# EAGLE design high-side-switch (EAGLE 9.6.2)
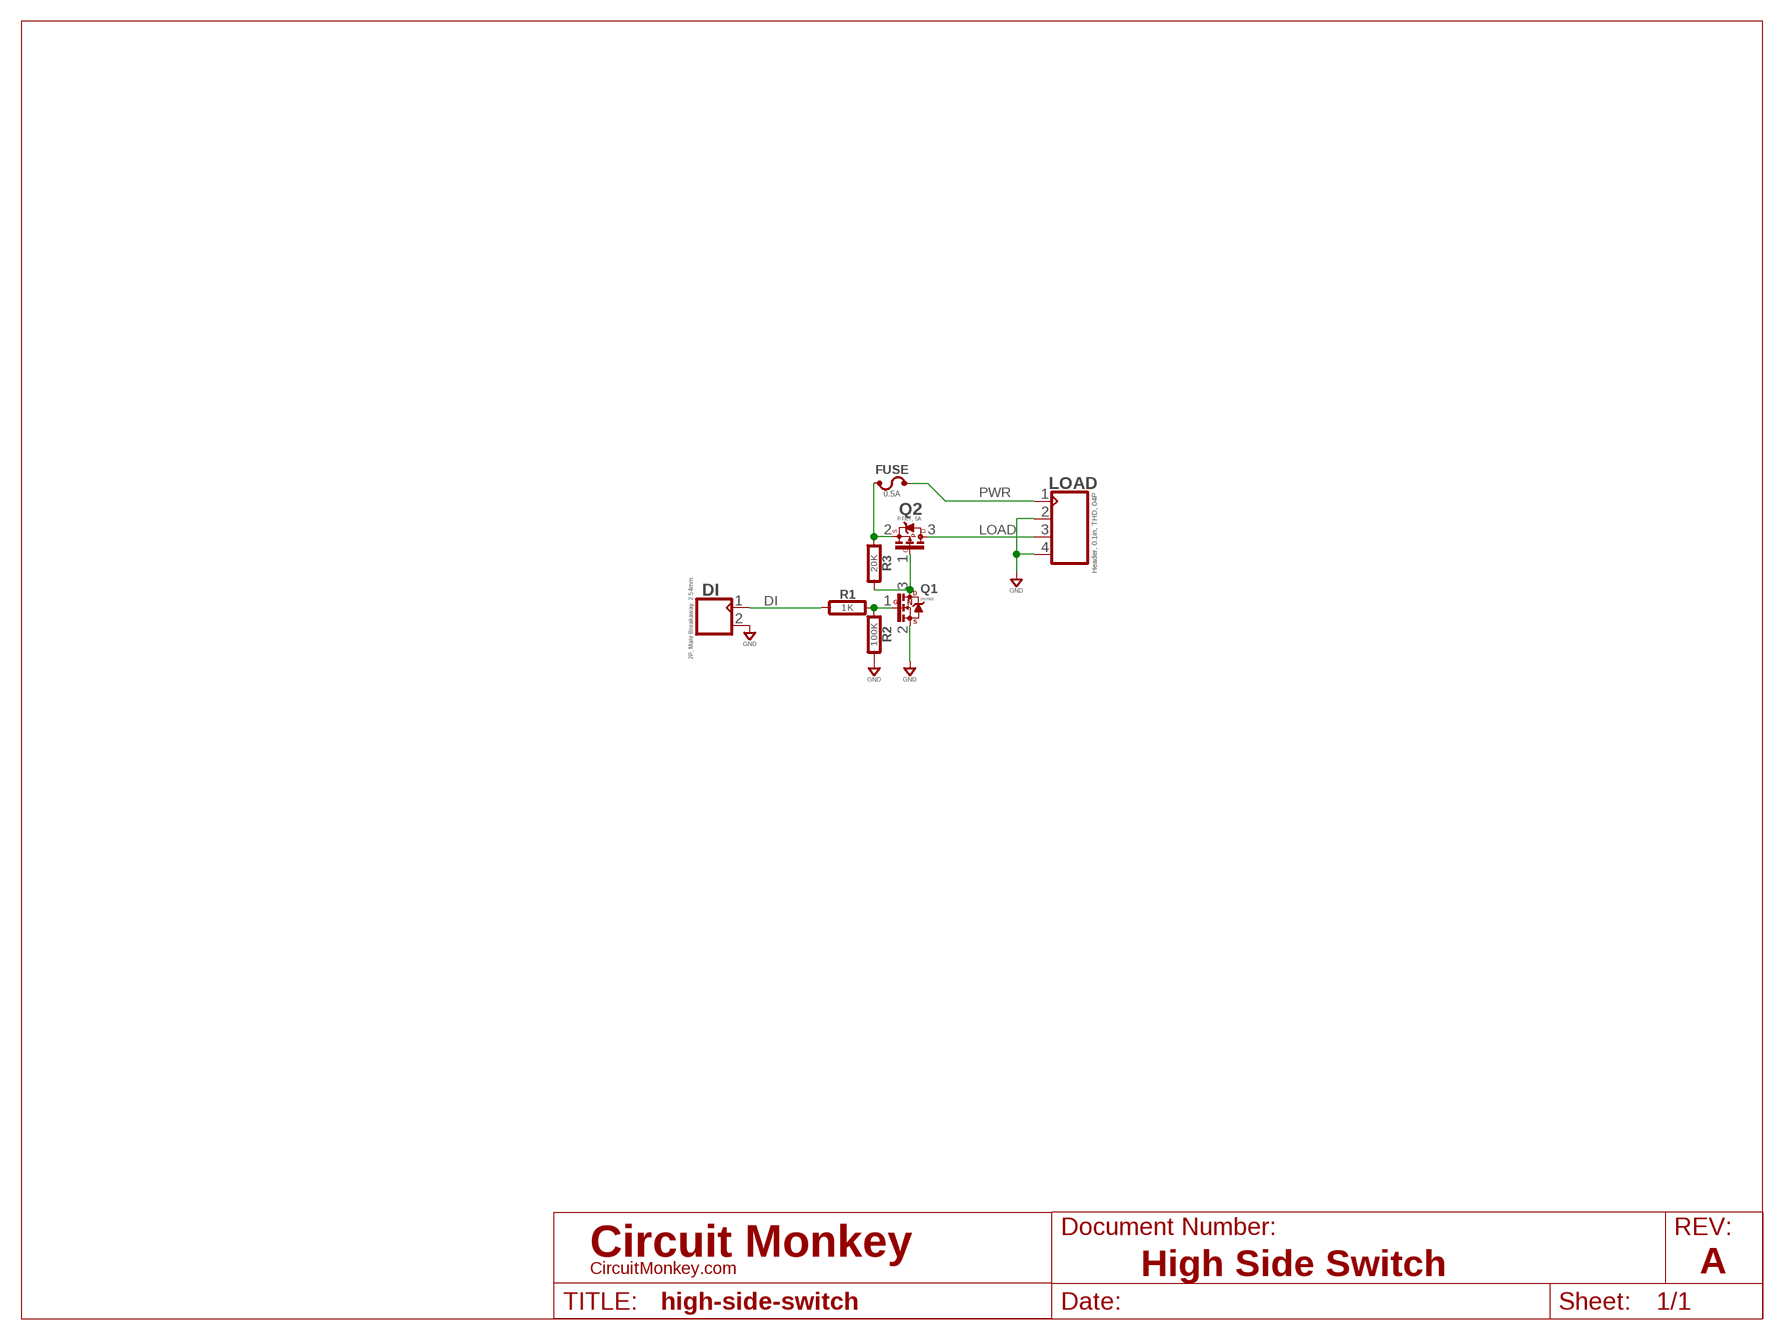
[diagram p0: schematic, sheet 1]
U$1 (LETTER_L-CIRCUITMONKEY): DOCUMENT_NUMBER: High Side Switch; REV: A

## Parts
DI  2P, Male Breakaway, 2.54mm  CON_02X1-2.54MM-THD-VT  [MA02X1-VT-THD]
FUSE  0.5A  FUSEBOURNS-MF-MSMF  [BOURNS-MF-MSMF]
LOAD  Header, 0.1in, THD, 04P  CON_04X1-THD-VT  [MA04X1-VT-THD]
Q1  2N7002  N-FET_2N7002  [SOT-23]
Q2  P-FET, 5A  P-FETSOT-23-5A  [SOT-23]
R1  1K  RESISTOR0603  [0603-RES]
R2  100K  RESISTOR0603  [0603-RES]
R3  20K  RESISTOR0603  [0603-RES]

## Nets
DI: DI.1 R1.1
GND: DI.2 LOAD.2 LOAD.4 Q1.2(S) R2.2
LOAD: LOAD.3 Q2.3(D)
NGATE: Q1.1(G) R1.2 R2.1
PFUSE: FUSE.2 Q2.2(S) R3.1
PGATE: Q1.3(D) Q2.1(G) R3.2
PWR: FUSE.1 LOAD.1

## Library data of the parts
DI = con-headers:CON_02X1: Connector, 2P
FUSE = fuse:FUSE: Fuse; COST01: 0.75; COST10: 0.60; COST100: 0.50; MFR: BOURNS; MPN: MF-MSMF*
LOAD = con-headers:CON_04X1: Headers, 04 pin; MFR: Molex; MPN: 022284043
Q1 = transistor-fet:N-FET: FET; COST01: 0.20; COST10: 0.16; COST100: 0.09; IDS: 0.2A; MPN: 2N7002; RDS: 0.05 ohm
Q2 = transistor-fet:P-FET: P-FET (PFET); COST01: 0.50; COST10: 0.35; COST100: 0.25; MFR: Siliconix; MPN: SI2347DS
R1-R3 = rlc:RESISTOR: Resistor; COST01: 0.10; COST10: 0.05; COST100: 0.02

## Board
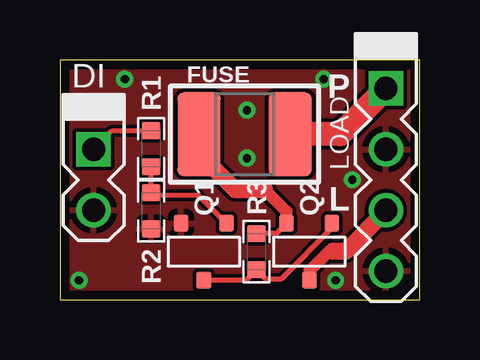
[diagram p1: board, top side]
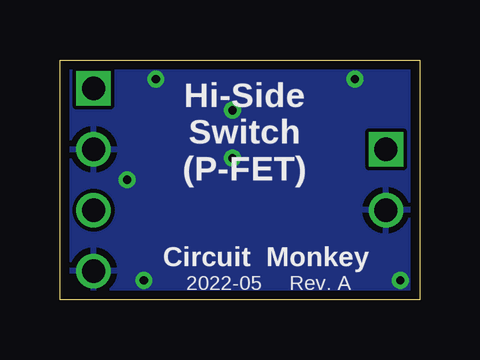
[diagram p2: board, bottom side, seen from below]

Size 15 x 10 mm. Coordinates in mm from the lower left corner, seen from the top.
Outline: 0,0 15,0 15,10 0,10 0,0
Copper layers (1*16): Top 0.0356mm / dielectric 1.5011mm / Bottom 0.0356mm
Design rules "OSH-CircuitMonkey *": minimum track width 6mil, minimum drill 13mil, track to track 6mil, track to pad 6mil, pad to pad 6mil, via to via 6mil, smd to smd 6mil, copper to edge 15mil, drill to drill 6mil, minimum pad ring 7mil, minimum via ring 7mil, stop-mask expansion 3mil, vias tented up to drill 14mil, thermal gap 10mil

### Footprints (pad centres in the part's own frame; a part is rotated, then mirrored left to right if it is on the bottom)
MA02X1-VT-THD = drill 0.965 square: 1 -1.27,0 | drill 0.965: 2 1.27,0
BOURNS-MF-MSMF = smd 1.8 x 3.5: 1 -1.9,0; 2 1.9,0
MA04X1-VT-THD = drill 0.965 square: 1 -3.81,0 | drill 0.965: 2 -1.27,0; 3 1.27,0; 4 3.81,0
SOT-23 = smd 0.6 x 0.7: 1 -0.95,-1.18; 2 0.95,-1.18; 3 0,1.18
0603-RES = smd 0.711 x 0.762: 1 -0.752,0; 2 0.752,0

### Placement (x,y rotation side)
DI  1.4,5 270 top
FUSE  7.7,6.9 180 top
LOAD  13.6,5 270 top
Q1  6,2 180 top
Q2  10.4,2 180 top
R1  3.8,6.3 270 top
R2  3.8,3.7 270 top
R3  8.2,2 270 top

### Tracks (layer width: path | path; a pad name or v marks a point on that pad's centre or on a via)
DI
  Top 0.2: DI.1 2.18,7.05 R1.1
GND  (via drill 0.35)
  other vias: 2.7,9.2 11,9.2 11.5,0.8 0.8,0.8 7.8,5.9 7.8,7.9 12.2,5
  pour Top: 0,0 0,10 15,10 15,0
  pour Bottom: 0,0 0,10 15,10 15,0
LOAD
  Top 0.5: Q2.3 10.4,1.2 11.22,2.02 11.4,2.02
  Top 0.7: 11.4,2.02 11.92,2.02 13.6,3.7 LOAD.3
NGATE
  Top 0.2: Q1.1 5.78,4.35 3.9,4.35 R2.1 R1.2
PFUSE
  Top 0.2: Q2.2 9.02,2.75 R3.1
  Top 0.5: Q2.2 9.45,3.68 8.55,4.58
  Top 0.7: FUSE.2 5.8,6.1 7.32,4.58 8.55,4.58
PGATE
  Top 0.2: Q2.1 11.35,2.98 9.22,0.85 8.6,0.85 R3.2 7.77,0.82 Q1.3
PWR
  Top 1: LOAD.1 11.69,6.9 FUSE.1

### Text on the board
tPlace: P | L
bPlace: Hi-Side / Switch / (P-FET) | Circuit Monkey | 2022-05 Rev. A